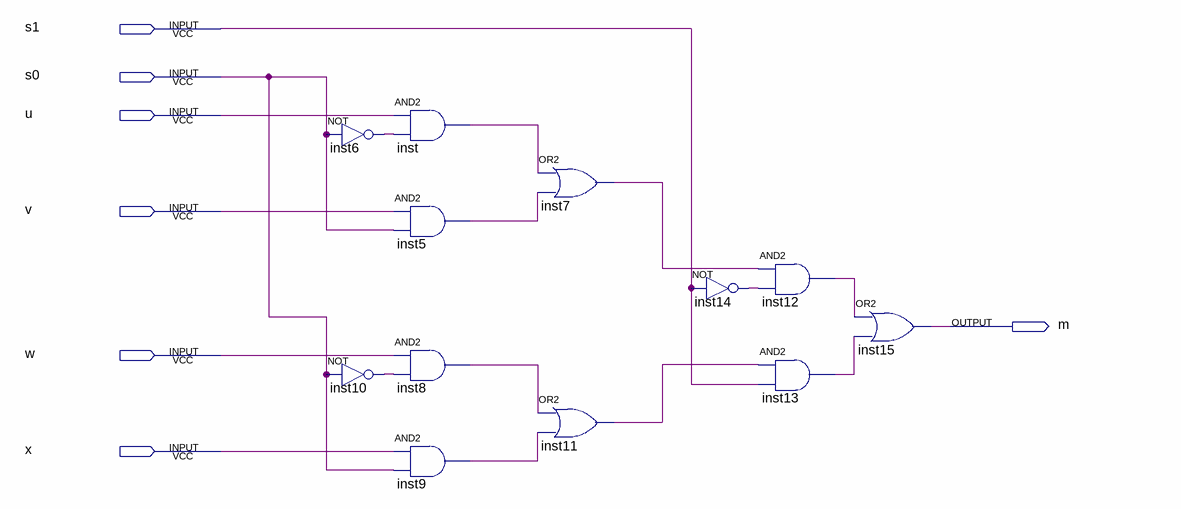
[diagram p0: schematic sheet]
// Quartus schematic showpart0.bdf as structural Verilog: 12 symbols, 7 pins
module showpart0 (
  input  s1,
  input  s0,
  input  u,
  input  v,
  input  w,
  input  x,
  output m
);

  wire inst5_out, inst6_out, inst7_out, inst8_out, inst9_out, inst10_out, inst11_out, inst12_out, inst13_out,
       inst14_out, inst_out;

  not inst6 (inst6_out, s0);
  not inst10 (inst10_out, s0);
  and inst (inst_out, u, inst6_out);
  and inst5 (inst5_out, v, s0);
  and inst8 (inst8_out, w, inst10_out);
  and inst9 (inst9_out, x, s0);
  or inst7 (inst7_out, inst_out, inst5_out);
  or inst11 (inst11_out, inst8_out, inst9_out);
  not inst14 (inst14_out, s1);
  and inst12 (inst12_out, inst7_out, inst14_out);
  and inst13 (inst13_out, inst11_out, s1);
  or inst15 (m, inst12_out, inst13_out);
endmodule
